# Altium schematic sheet TCAN3413DR1_TCAN3413DR.schdoc
size 127 x 99 mm
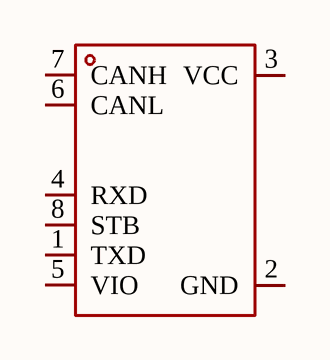
[diagram p0: TCAN3413DR1_TCAN3413DR.schdoc]

## Parts
U?  TCAN3413DR  [SOP-8_L4.9-W3.9-P1.27-LS6.0-BL-1]  (value not drawn)

## Nets

Not connected (* = marked no-connect by the designer): U? 1(TXD) 2(GND) 3(VCC) 4(RXD) 5(VIO) 6(CANL) 7(CANH) 8(STB)

## Library data of the parts
U? = TCAN3413DR: Manufacturer: TI(德州仪器); Add into BOM: yes; Data Rate: 5Mbps; Voltage - Supply: 3V~3.6V; Current - Supply: 42mA; Supply Current (Iq): 4uA; Symbol: TCAN3413DR; Device: TCAN3413DR; LCSC Part Name: TCAN3413 3.3-V CAN FD 收发器; Supplier Part: C22433320; Manufacturer Part: TCAN3413DR; Supplier Footprint: SOIC-8; JLCPCB Part Class: Extended Part; Datasheet: https://www.ti.com.cn/cn/lit/ds/symlink/tcan3413.pdf?ts=1739433172079&ref_url=https%253A%252F%252Fwww.ti.com.cn%252Fsitesearch%252Fzh-cn%252Fdocs%252Funiversalsearch.tsp%253FlangPref%253Dzh-CN%2526nr%253D19%2526searchTerm%253DTCAN3413DR; Supplier: LCSC; Convert to PCB: yes; Type: CAN FD Transceiver; Operating Temperature: -40℃~+125℃